# Altium schematic sheet Amplifier.SchDoc
size A; SheetNumber: 3; SheetTotal: 5
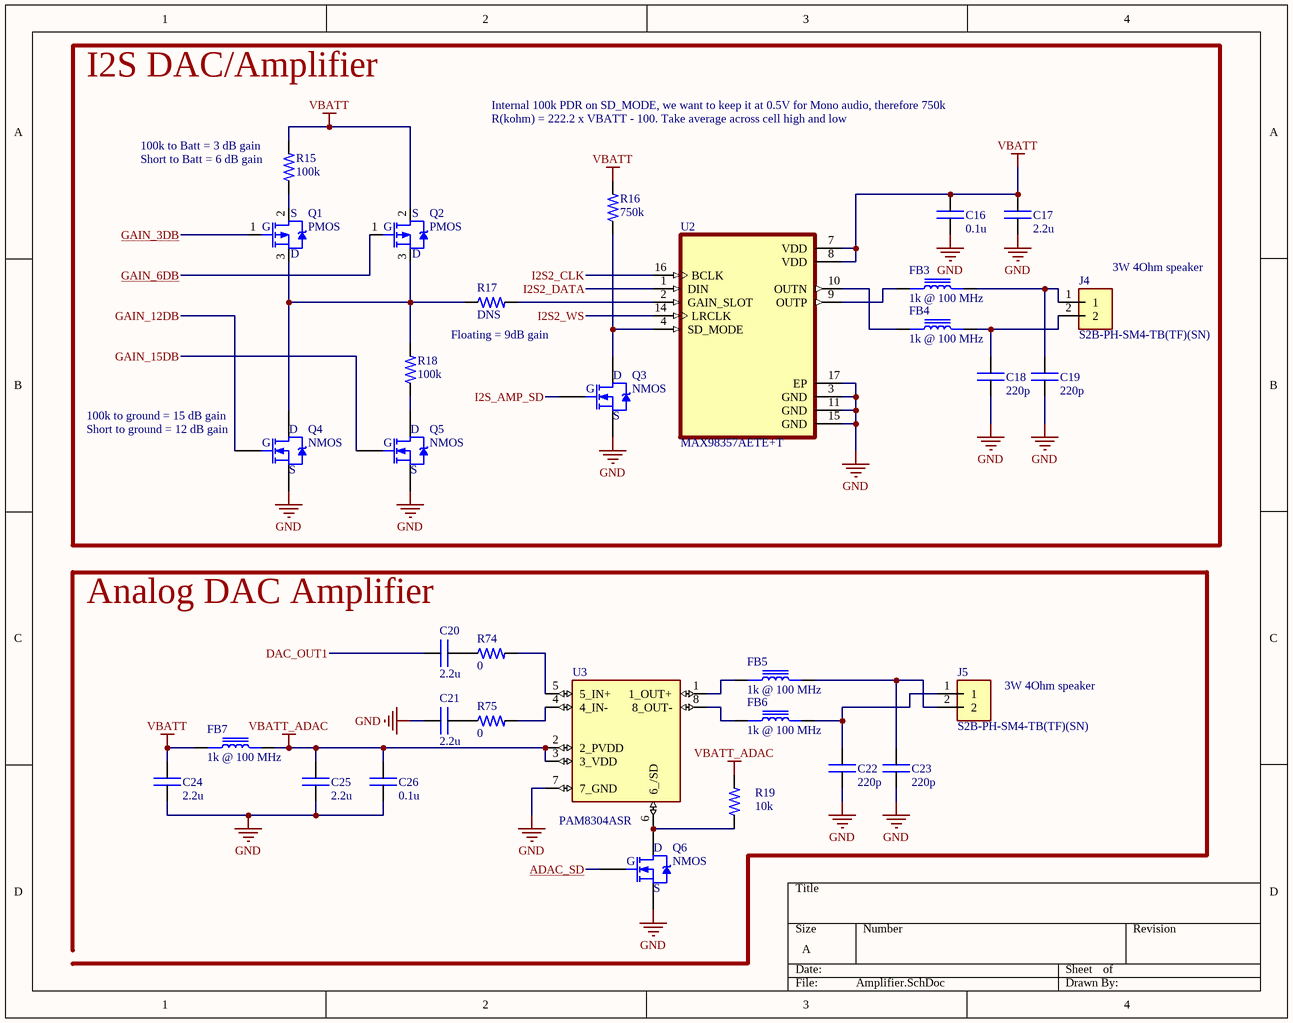
[diagram p0: Amplifier.SchDoc]

## Parts
C16  value 0.1u  [0603-CAP]  (hidden comment: CAP)
C17  value 2.2u  [0603-CAP]  (hidden comment: CAP)
C18  value 220p  [0603-CAP]  (hidden comment: CAP)
C19  value 220p  [0603-CAP]  (hidden comment: CAP)
C20  value 2.2u  [0603-CAP]  (hidden comment: CAP)
C21  value 2.2u  [0603-CAP]  (hidden comment: CAP)
C22  value 220p  [0603-CAP]  (hidden comment: CAP)
C23  value 220p  [0603-CAP]  (hidden comment: CAP)
C24  value 2.2u  [0603-CAP]  (hidden comment: CAP)
C25  value 2.2u  [0603-CAP]  (hidden comment: CAP)
C26  value 0.1u  [0603-CAP]  (hidden comment: CAP)
FB3  1k @ 100 MHz  [0603-FB]
FB4  1k @ 100 MHz  [0603-FB]
FB5  1k @ 100 MHz  [0603-FB]
FB6  1k @ 100 MHz  [0603-FB]
FB7  1k @ 100 MHz  [0603-FB]
J4  S2B-PH-SM4-TB(TF)(SN)  [JST_PH-2POS-SMT-RA]
J5  S2B-PH-SM4-TB(TF)(SN)  [JST_PH-2POS-SMT-RA]
Q1  PMOS  [SOT-23]
Q2  PMOS  [SOT-23]
Q3  NMOS  [SOT-23]
Q4  NMOS  [SOT-23]
Q5  NMOS  [SOT-23]
Q6  NMOS  [SOT-23]
R15  value 100k  [0603-RES]  (hidden comment: RES)
R16  value 750k  [0603-RES]  (hidden comment: RES)
R17  value DNS  [0603-RES]  (hidden comment: RES)
R18  value 100k  [0603-RES]  (hidden comment: RES)
R19  value 10k  [0603-RES]  (hidden comment: RES)
R74  value 0  [0603-RES]  (hidden comment: RES)
R75  value 0  [0603-RES]  (hidden comment: RES)
U2  MAX98357AETE+T  [16-WFQFN EXPOSED PAD]
U3  PAM8304ASR  [8-TSSOP]

## Blocks framed on the sheet
I2S DAC/Amplifier: C16-C19 FB3 FB4 J4 Q1-Q5 R15-R18 U2

## Nets
GND: C16.1 C17.1 C18.1 C19.1 C21.1 C22.1 C23.1 C24.1 C25.1 C26.1 Q3.2(S) Q4.2(S) Q5.2(S) Q6.2(S) U2.3(GND) U2.11(GND) U2.15(GND) U2.17(EP) U3.7(7_GND)
VBATT: C16.2 C17.2 C24.2 FB7.1 Q2.2(D) R15.2 R16.2 U2.7(VDD) U2.8(VDD)
VBATT_ADAC: C25.2 C26.2 FB7.2 R19.2 U3.2(2_PVDD) U3.3(3_VDD)
ADAC_SD: Q6.1(G)
DAC_OUT1: C20.1
GAIN_3DB: Q1.1(G)
GAIN_6DB: Q2.1(G)
GAIN_12DB: Q4.1(G)
GAIN_15DB: Q5.1(G)
I2S2_CLK: U2.16(BCLK)
I2S2_DATA: U2.1(DIN)
I2S2_WS: U2.14(LRCLK)
I2S_AMP_SD: Q3.1(G)
NetC18_2: C18.2 FB4.2 J4.2
NetC19_2: C19.2 FB3.2 J4.1
NetC20_2: C20.2 R74.1
NetC21_2: C21.2 R75.1
NetC22_2: C22.2 FB6.2 J5.1
NetC23_2: C23.2 FB5.2 J5.2
NetFB3_1: FB3.1 U2.9(OUTP)
NetFB4_1: FB4.1 U2.10(OUTN)
NetFB5_1: FB5.1 U3.1(1_OUT+)
NetFB6_1: FB6.1 U3.8(8_OUT-)
NetQ1_2: Q1.2(D) R15.1
NetQ1_3: Q1.3(S) Q2.3(S) Q4.3(D) R17.1 R18.2
NetQ3_3: Q3.3(D) R16.1 U2.4(SD_MODE)
NetQ5_3: Q5.3(D) R18.1
NetQ6_3: Q6.3(D) R19.1 U3.6(6_/SD)
NetR17_2: R17.2 U2.2(GAIN_SLOT)
NetR74_2: R74.2 U3.5(5_IN+)
NetR75_2: R75.2 U3.4(4_IN-)

## Notes on the sheet
- (near R15) 100k to Batt = 3 dB gain
- (near R15) Short to Batt = 6 dB gain
- Internal 100k PDR on SD_MODE, we want to keep it at 0.5V for Mono audio, therefore 750k
- R(kohm) = 222.2 x VBATT - 100. Take average across cell high and low
- (near J4) 3W 4Ohm speaker
- Floating = 9dB gain
- (near Q4) 100k to ground = 15 dB gain
- (near Q4) Short to ground = 12 dB gain
- Analog DAC Amplifier
- (near J5) 3W 4Ohm speaker

## Library data of the parts
C16-C26 = CAP: Capaicitor; Type: SMD; MFR: *; MFR PN: *
FB3-FB7 = FERRITE BEAD: MFR: TDK; MFR PN: MMZ1608Y102BTD25; Type: SMD
J4 J5 = JST CONN 2POS PH: Connector Header Surface Mount, Right Angle 2 position 0.079 (2.00mm); MFR: JST Sales; MFR PN: S2B-PH-SM4-TB(TF)(SN); Type: SMD
Q1 Q2 = PMOS: P-Channel MOSFET; MFR PN: BSS84-7-F; MFR: Diodes Incorporated; Type: SMD
Q3-Q6 = NMOS: N-Channel MOSFET; MFR PN: DMN63D8L; MFR: Diodes Incorporated; Type: SMD
R15-R19 R74 R75 = RES: Resistor; MFR PN: *; MFR: *; Type: SMD
U2 = MAX98357AETE+T: I2S Audio DAC and amp; MFR: Analog Devices; MFR PN: MAX98357AETE+T; Type: SMD
U3 = AMP 3W ANALOG: Amplifier IC 1-Channel (Mono) Class D 8L-MSOP; MFR: Diodes Inc.; MFR PN: PAM8304ASR; Type: SMD